# EAGLE design PiKeyboard (EAGLE 7.5.0)
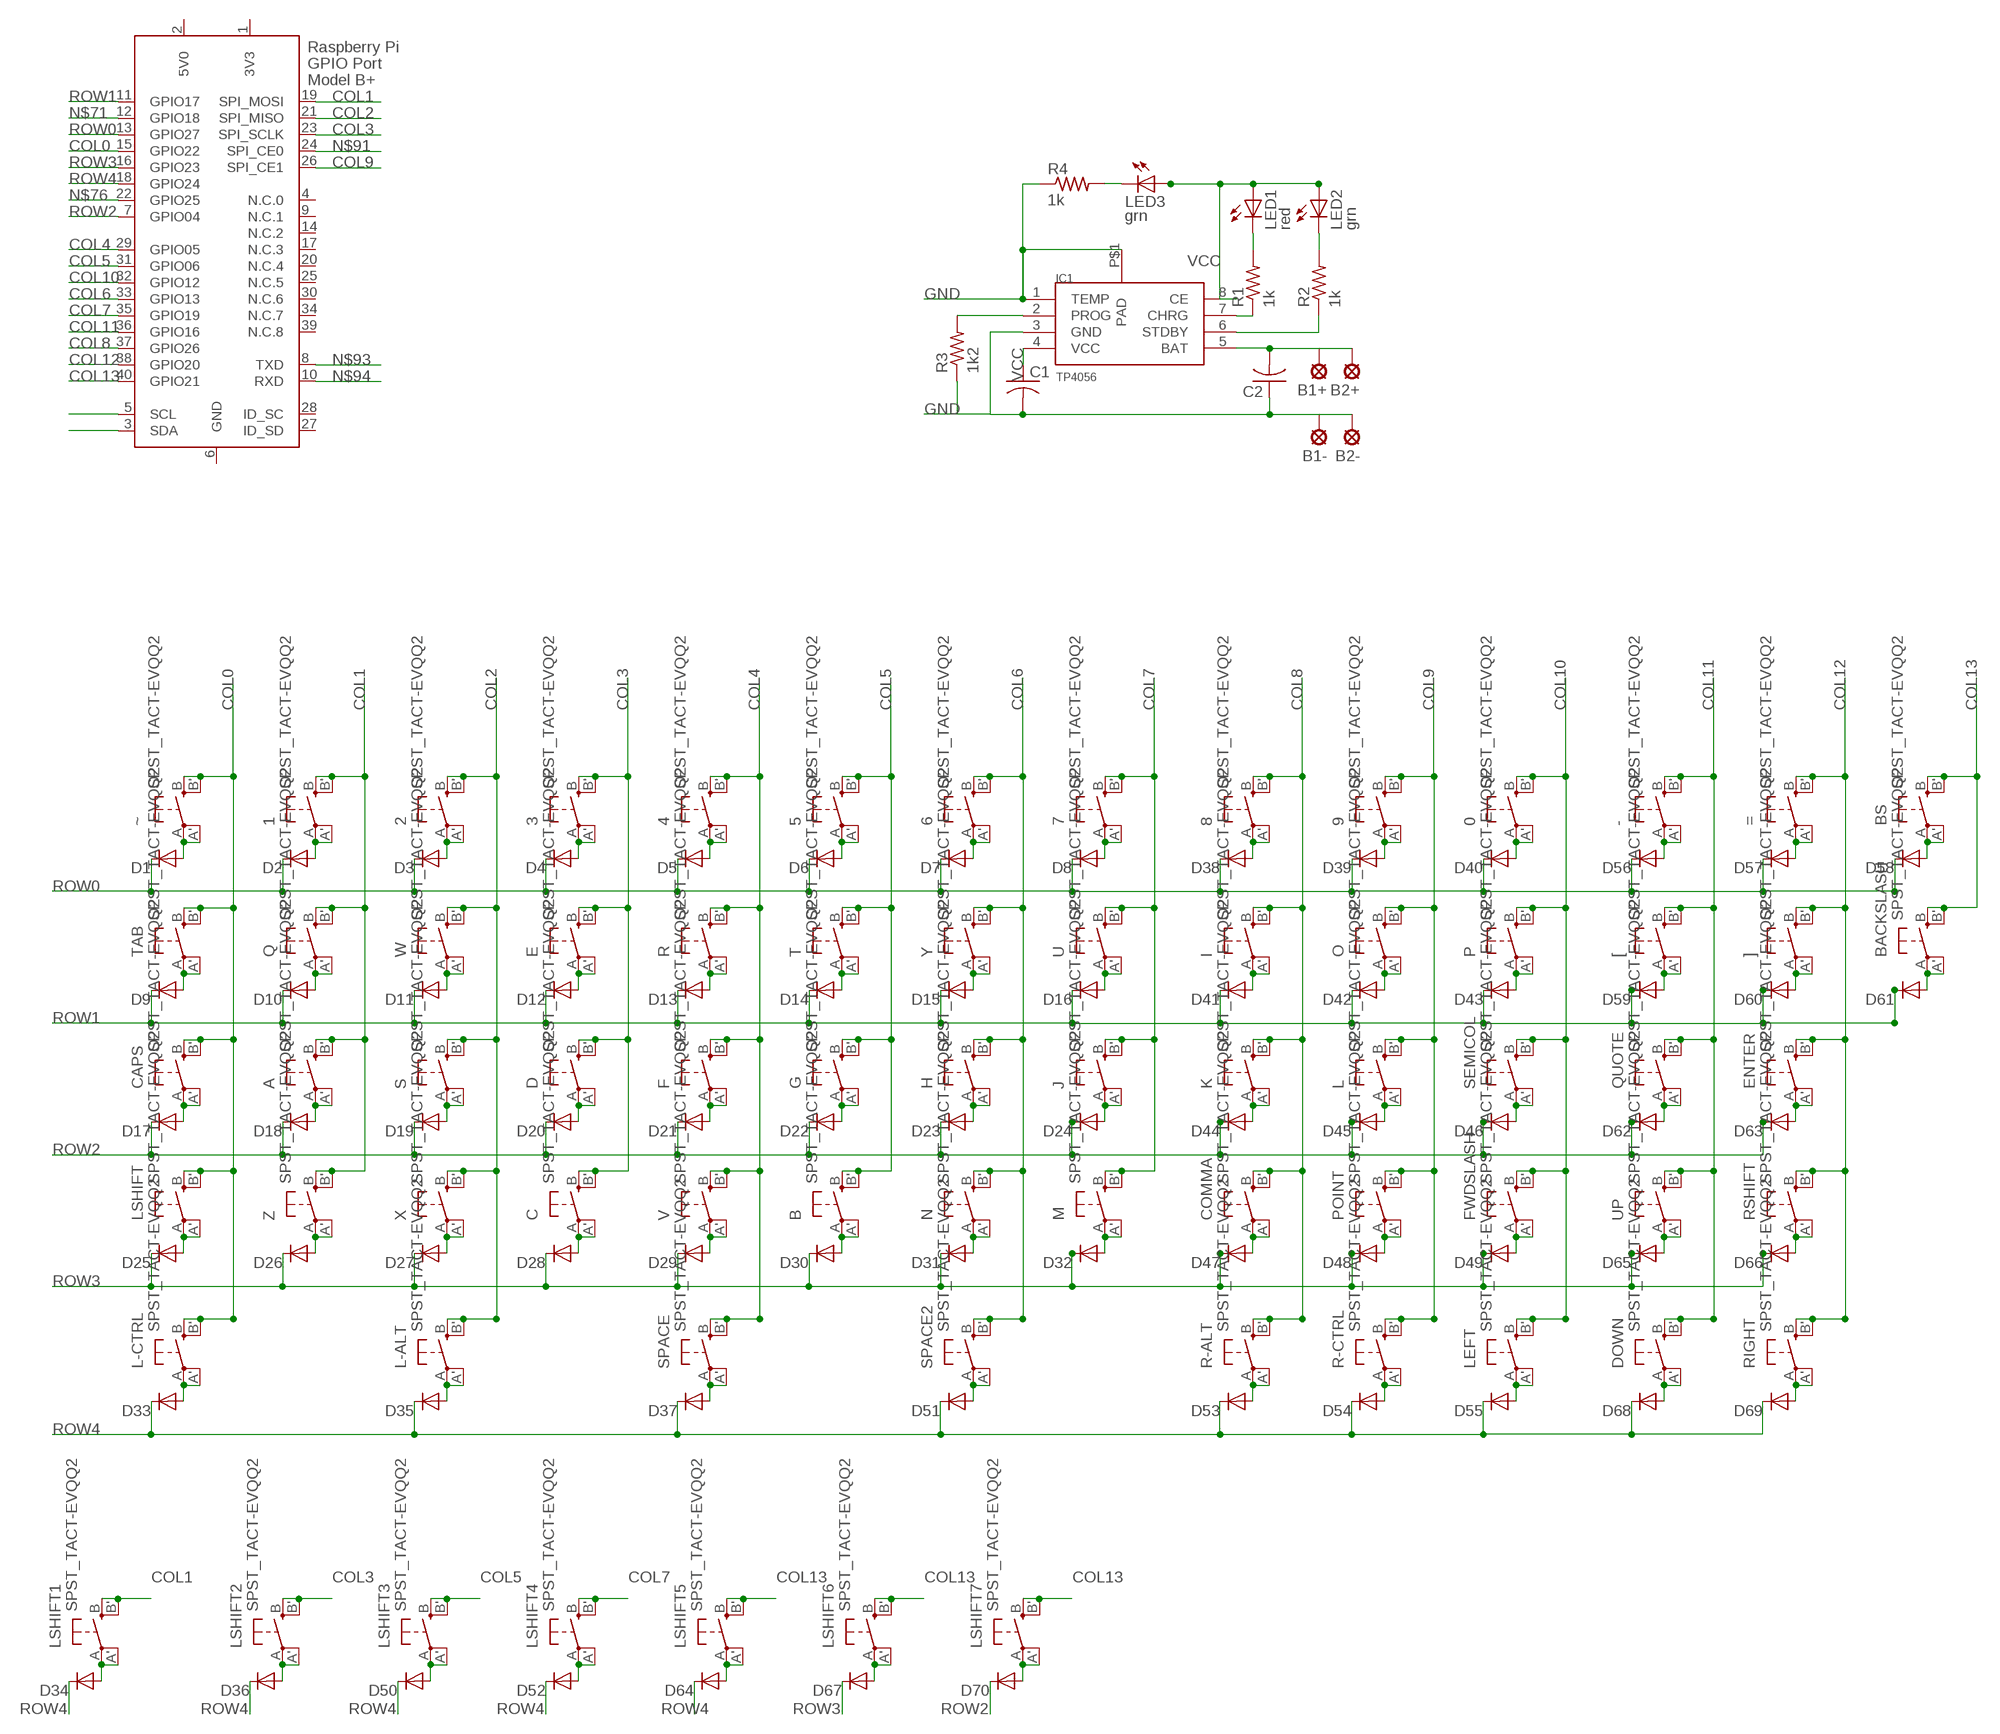
[diagram p0: schematic, sheet 1]

## Parts
0  SPST_TACT-EVQQ2  [EVQ-Q2]
1  SPST_TACT-EVQQ2  [EVQ-Q2]
2  SPST_TACT-EVQQ2  [EVQ-Q2]
3  SPST_TACT-EVQQ2  [EVQ-Q2]
4  SPST_TACT-EVQQ2  [EVQ-Q2]
5  SPST_TACT-EVQQ2  [EVQ-Q2]
6  SPST_TACT-EVQQ2  [EVQ-Q2]
7  SPST_TACT-EVQQ2  [EVQ-Q2]
8  SPST_TACT-EVQQ2  [EVQ-Q2]
9  SPST_TACT-EVQQ2  [EVQ-Q2]
-  SPST_TACT-EVQQ2  [EVQ-Q2]
=  SPST_TACT-EVQQ2  [EVQ-Q2]
[  SPST_TACT-EVQQ2  [EVQ-Q2]
]  SPST_TACT-EVQQ2  [EVQ-Q2]
A  SPST_TACT-EVQQ2  [EVQ-Q2]
B  SPST_TACT-EVQQ2  [EVQ-Q2]
B1+  SE14  [SE14]
B1-  SE14  [SE14]
B2+  SE14  [SE14]
B2-  SE14  [SE14]
BACKSLASH  SPST_TACT-EVQQ2  [EVQ-Q2]
BS  SPST_TACT-EVQQ2  [EVQ-Q2]
C  SPST_TACT-EVQQ2  [EVQ-Q2]
C1  C-USC1206K  [C1206K]
C2  C-USC1206K  [C1206K]
CAPS  SPST_TACT-EVQQ2  [EVQ-Q2]
COMMA  SPST_TACT-EVQQ2  [EVQ-Q2]
D  SPST_TACT-EVQQ2  [EVQ-Q2]
D1  DIODE-DO214AC  [DO214AC]
D2  DIODE-DO214AC  [DO214AC]
D3  DIODE-DO214AC  [DO214AC]
D4  DIODE-DO214AC  [DO214AC]
D5  DIODE-DO214AC  [DO214AC]
D6  DIODE-DO214AC  [DO214AC]
D7  DIODE-DO214AC  [DO214AC]
D8  DIODE-DO214AC  [DO214AC]
D9  DIODE-DO214AC  [DO214AC]
D10  DIODE-DO214AC  [DO214AC]
D11  DIODE-DO214AC  [DO214AC]
D12  DIODE-DO214AC  [DO214AC]
D13  DIODE-DO214AC  [DO214AC]
D14  DIODE-DO214AC  [DO214AC]
D15  DIODE-DO214AC  [DO214AC]
D16  DIODE-DO214AC  [DO214AC]
D17  DIODE-DO214AC  [DO214AC]
D18  DIODE-DO214AC  [DO214AC]
D19  DIODE-DO214AC  [DO214AC]
D20  DIODE-DO214AC  [DO214AC]
D21  DIODE-DO214AC  [DO214AC]
D22  DIODE-DO214AC  [DO214AC]
D23  DIODE-DO214AC  [DO214AC]
D24  DIODE-DO214AC  [DO214AC]
D25  DIODE-DO214AC  [DO214AC]
D26  DIODE-DO214AC  [DO214AC]
D27  DIODE-DO214AC  [DO214AC]
D28  DIODE-DO214AC  [DO214AC]
D29  DIODE-DO214AC  [DO214AC]
D30  DIODE-DO214AC  [DO214AC]
D31  DIODE-DO214AC  [DO214AC]
D32  DIODE-DO214AC  [DO214AC]
D33  DIODE-DO214AC  [DO214AC]
D34  DIODE-DO214AC  [DO214AC]
D35  DIODE-DO214AC  [DO214AC]
D36  DIODE-DO214AC  [DO214AC]
D37  DIODE-DO214AC  [DO214AC]
D38  DIODE-DO214AC  [DO214AC]
D39  DIODE-DO214AC  [DO214AC]
D40  DIODE-DO214AC  [DO214AC]
D41  DIODE-DO214AC  [DO214AC]
D42  DIODE-DO214AC  [DO214AC]
D43  DIODE-DO214AC  [DO214AC]
D44  DIODE-DO214AC  [DO214AC]
D45  DIODE-DO214AC  [DO214AC]
D46  DIODE-DO214AC  [DO214AC]
D47  DIODE-DO214AC  [DO214AC]
D48  DIODE-DO214AC  [DO214AC]
D49  DIODE-DO214AC  [DO214AC]
D50  DIODE-DO214AC  [DO214AC]
D51  DIODE-DO214AC  [DO214AC]
D52  DIODE-DO214AC  [DO214AC]
D53  DIODE-DO214AC  [DO214AC]
D54  DIODE-DO214AC  [DO214AC]
D55  DIODE-DO214AC  [DO214AC]
D56  DIODE-DO214AC  [DO214AC]
D57  DIODE-DO214AC  [DO214AC]
D58  DIODE-DO214AC  [DO214AC]
D59  DIODE-DO214AC  [DO214AC]
D60  DIODE-DO214AC  [DO214AC]
D61  DIODE-DO214AC  [DO214AC]
D62  DIODE-DO214AC  [DO214AC]
D63  DIODE-DO214AC  [DO214AC]
D64  DIODE-DO214AC  [DO214AC]
D65  DIODE-DO214AC  [DO214AC]
D66  DIODE-DO214AC  [DO214AC]
D67  DIODE-DO214AC  [DO214AC]
D68  DIODE-DO214AC  [DO214AC]
D69  DIODE-DO214AC  [DO214AC]
D70  DIODE-DO214AC  [DO214AC]
DOWN  SPST_TACT-EVQQ2  [EVQ-Q2]
E  SPST_TACT-EVQQ2  [EVQ-Q2]
ENTER  SPST_TACT-EVQQ2  [EVQ-Q2]
F  SPST_TACT-EVQQ2  [EVQ-Q2]
FWDSLASH  SPST_TACT-EVQQ2  [EVQ-Q2]
G  SPST_TACT-EVQQ2  [EVQ-Q2]
H  SPST_TACT-EVQQ2  [EVQ-Q2]
I  SPST_TACT-EVQQ2  [EVQ-Q2]
IC1  TP4056  [SOP-8]
J  SPST_TACT-EVQQ2  [EVQ-Q2]
K  SPST_TACT-EVQQ2  [EVQ-Q2]
L  SPST_TACT-EVQQ2  [EVQ-Q2]
L-ALT  SPST_TACT-EVQQ2  [EVQ-Q2]
L-CTRL  SPST_TACT-EVQQ2  [EVQ-Q2]
LED1  red  LEDCHIPLED_1206  [CHIPLED_1206]
LED2  grn  LEDCHIPLED_1206  [CHIPLED_1206]
LED3  grn  LEDCHIPLED_1206  [CHIPLED_1206]
LEFT  SPST_TACT-EVQQ2  [EVQ-Q2]
LSHIFT  SPST_TACT-EVQQ2  [EVQ-Q2]
LSHIFT1  SPST_TACT-EVQQ2  [EVQ-Q2]
LSHIFT2  SPST_TACT-EVQQ2  [EVQ-Q2]
LSHIFT3  SPST_TACT-EVQQ2  [EVQ-Q2]
LSHIFT4  SPST_TACT-EVQQ2  [EVQ-Q2]
LSHIFT5  SPST_TACT-EVQQ2  [EVQ-Q2]
LSHIFT6  SPST_TACT-EVQQ2  [EVQ-Q2]
LSHIFT7  SPST_TACT-EVQQ2  [EVQ-Q2]
M  SPST_TACT-EVQQ2  [EVQ-Q2]
N  SPST_TACT-EVQQ2  [EVQ-Q2]
O  SPST_TACT-EVQQ2  [EVQ-Q2]
P  SPST_TACT-EVQQ2  [EVQ-Q2]
POINT  SPST_TACT-EVQQ2  [EVQ-Q2]
Q  SPST_TACT-EVQQ2  [EVQ-Q2]
QUOTE  SPST_TACT-EVQQ2  [EVQ-Q2]
R  SPST_TACT-EVQQ2  [EVQ-Q2]
R1  1k  R-US_M1206  [M1206]
R2  1k  R-US_M1206  [M1206]
R3  1k2  R-US_M1206  [M1206]
R4  1k  R-US_M1206  [M1206]
R-ALT  SPST_TACT-EVQQ2  [EVQ-Q2]
R-CTRL  SPST_TACT-EVQQ2  [EVQ-Q2]
RIGHT  SPST_TACT-EVQQ2  [EVQ-Q2]
RSHIFT  SPST_TACT-EVQQ2  [EVQ-Q2]
S  SPST_TACT-EVQQ2  [EVQ-Q2]
SEMICOL  SPST_TACT-EVQQ2  [EVQ-Q2]
SPACE  SPST_TACT-EVQQ2  [EVQ-Q2]
SPACE2  SPST_TACT-EVQQ2  [EVQ-Q2]
T  SPST_TACT-EVQQ2  [EVQ-Q2]
TAB  SPST_TACT-EVQQ2  [EVQ-Q2]
U  SPST_TACT-EVQQ2  [EVQ-Q2]
UP  SPST_TACT-EVQQ2  [EVQ-Q2]
V  SPST_TACT-EVQQ2  [EVQ-Q2]
W  SPST_TACT-EVQQ2  [EVQ-Q2]
X  SPST_TACT-EVQQ2  [EVQ-Q2]
X1  RASPI_BOARD_B+_F  [RASPI_BOARD_B+_FULL]
Y  SPST_TACT-EVQQ2  [EVQ-Q2]
Z  SPST_TACT-EVQQ2  [EVQ-Q2]
~  SPST_TACT-EVQQ2  [EVQ-Q2]

## Nets
BATT+: B1+.MP B2+.MP C2.2 IC1.5(BAT)
CHGLED: IC1.7(CHRG) R1.1
CHRG: LED1.C R1.2
COL0: CAPS.B'(S1) CAPS.B(S) L-CTRL.B'(S1) L-CTRL.B(S) LSHIFT.B'(S1) LSHIFT.B(S) TAB.B'(S1) TAB.B(S) X1.15(GPIO22) ~.B'(S1) ~.B(S)
COL1: 1.B'(S1) 1.B(S) A.B'(S1) A.B(S) LSHIFT1.B'(S1) LSHIFT1.B(S) Q.B'(S1) Q.B(S) X1.19(SPI_MOSI) Z.B'(S1) Z.B(S)
COL2: 2.B'(S1) 2.B(S) L-ALT.B'(S1) L-ALT.B(S) S.B'(S1) S.B(S) W.B'(S1) W.B(S) X1.21(SPI_MISO) X.B'(S1) X.B(S)
COL3: 3.B'(S1) 3.B(S) C.B'(S1) C.B(S) D.B'(S1) D.B(S) E.B'(S1) E.B(S) LSHIFT2.B'(S1) LSHIFT2.B(S) X1.23(SPI_SCLK)
COL4: 4.B'(S1) 4.B(S) F.B'(S1) F.B(S) R.B'(S1) R.B(S) SPACE.B'(S1) SPACE.B(S) V.B'(S1) V.B(S) X1.29(GPIO05)
COL5: 5.B'(S1) 5.B(S) B.B'(S1) B.B(S) G.B'(S1) G.B(S) LSHIFT3.B'(S1) LSHIFT3.B(S) T.B'(S1) T.B(S) X1.31(GPIO06)
COL6: 6.B'(S1) 6.B(S) H.B'(S1) H.B(S) N.B'(S1) N.B(S) SPACE2.B'(S1) SPACE2.B(S) X1.33(GPIO13) Y.B'(S1) Y.B(S)
COL7: 7.B'(S1) 7.B(S) J.B'(S1) J.B(S) LSHIFT4.B'(S1) LSHIFT4.B(S) M.B'(S1) M.B(S) U.B'(S1) U.B(S) X1.35(GPIO19)
COL8: 8.B'(S1) 8.B(S) COMMA.B'(S1) COMMA.B(S) I.B'(S1) I.B(S) K.B'(S1) K.B(S) R-ALT.B'(S1) R-ALT.B(S) X1.37(GPIO26)
COL9: 9.B'(S1) 9.B(S) L.B'(S1) L.B(S) O.B'(S1) O.B(S) POINT.B'(S1) POINT.B(S) R-CTRL.B'(S1) R-CTRL.B(S) X1.26(SPI_CE1)
COL10: 0.B'(S1) 0.B(S) FWDSLASH.B'(S1) FWDSLASH.B(S) LEFT.B'(S1) LEFT.B(S) P.B'(S1) P.B(S) SEMICOL.B'(S1) SEMICOL.B(S) X1.32(GPIO12)
COL11: -.B'(S1) -.B(S) [.B'(S1) [.B(S) DOWN.B'(S1) DOWN.B(S) QUOTE.B'(S1) QUOTE.B(S) UP.B'(S1) UP.B(S) X1.36(GPIO16)
COL12: =.B'(S1) =.B(S) ].B'(S1) ].B(S) ENTER.B'(S1) ENTER.B(S) RIGHT.B'(S1) RIGHT.B(S) RSHIFT.B'(S1) RSHIFT.B(S) X1.38(GPIO20)
COL13: BACKSLASH.B'(S1) BACKSLASH.B(S) BS.B'(S1) BS.B(S) LSHIFT5.B'(S1) LSHIFT5.B(S) LSHIFT6.B'(S1) LSHIFT6.B(S) LSHIFT7.B'(S1) LSHIFT7.B(S) X1.40(GPIO21)
GND: B1-.MP B2-.MP C1.2 C2.1 IC1.1(TEMP) IC1.3(GND) IC1.P$1(PAD) R3.1 R4.1
N$1: D1.A ~.A'(P1) ~.A(P)
N$2: 1.A'(P1) 1.A(P) D2.A
N$3: 2.A'(P1) 2.A(P) D3.A
N$4: 3.A'(P1) 3.A(P) D4.A
N$5: 4.A'(P1) 4.A(P) D5.A
N$6: 5.A'(P1) 5.A(P) D6.A
N$7: 6.A'(P1) 6.A(P) D7.A
N$8: 7.A'(P1) 7.A(P) D8.A
N$9: D9.A TAB.A'(P1) TAB.A(P)
N$10: D10.A Q.A'(P1) Q.A(P)
N$11: D11.A W.A'(P1) W.A(P)
N$12: D12.A E.A'(P1) E.A(P)
N$13: D13.A R.A'(P1) R.A(P)
N$14: D14.A T.A'(P1) T.A(P)
N$15: D15.A Y.A'(P1) Y.A(P)
N$16: D16.A U.A'(P1) U.A(P)
N$17: CAPS.A'(P1) CAPS.A(P) D17.A
N$18: A.A'(P1) A.A(P) D18.A
N$19: D19.A S.A'(P1) S.A(P)
N$20: D20.A D.A'(P1) D.A(P)
N$21: D21.A F.A'(P1) F.A(P)
N$22: D22.A G.A'(P1) G.A(P)
N$23: D23.A H.A'(P1) H.A(P)
N$24: D24.A J.A'(P1) J.A(P)
N$25: D25.A LSHIFT.A'(P1) LSHIFT.A(P)
N$26: D26.A Z.A'(P1) Z.A(P)
N$27: D27.A X.A'(P1) X.A(P)
N$28: C.A'(P1) C.A(P) D28.A
N$29: D29.A V.A'(P1) V.A(P)
N$30: B.A'(P1) B.A(P) D30.A
N$31: D31.A N.A'(P1) N.A(P)
N$32: D32.A M.A'(P1) M.A(P)
N$33: D33.A L-CTRL.A'(P1) L-CTRL.A(P)
N$34: D34.A LSHIFT1.A'(P1) LSHIFT1.A(P)
N$35: D36.A LSHIFT2.A'(P1) LSHIFT2.A(P)
N$36: D50.A LSHIFT3.A'(P1) LSHIFT3.A(P)
N$37: D37.A SPACE.A'(P1) SPACE.A(P)
N$38: 8.A'(P1) 8.A(P) D38.A
N$39: 9.A'(P1) 9.A(P) D39.A
N$40: 0.A'(P1) 0.A(P) D40.A
N$41: D41.A I.A'(P1) I.A(P)
N$42: D42.A O.A'(P1) O.A(P)
N$43: D43.A P.A'(P1) P.A(P)
N$44: D44.A K.A'(P1) K.A(P)
N$45: D45.A L.A'(P1) L.A(P)
N$46: D46.A SEMICOL.A'(P1) SEMICOL.A(P)
N$47: COMMA.A'(P1) COMMA.A(P) D47.A
N$48: D48.A POINT.A'(P1) POINT.A(P)
N$49: D49.A FWDSLASH.A'(P1) FWDSLASH.A(P)
N$50: D52.A LSHIFT4.A'(P1) LSHIFT4.A(P)
N$51: D51.A SPACE2.A'(P1) SPACE2.A(P)
N$52: D64.A LSHIFT5.A'(P1) LSHIFT5.A(P)
N$53: D53.A R-ALT.A'(P1) R-ALT.A(P)
N$54: D54.A R-CTRL.A'(P1) R-CTRL.A(P)
N$55: D55.A LEFT.A'(P1) LEFT.A(P)
N$56: -.A'(P1) -.A(P) D56.A
N$57: =.A'(P1) =.A(P) D57.A
N$58: BS.A'(P1) BS.A(P) D58.A
N$59: [.A'(P1) [.A(P) D59.A
N$60: ].A'(P1) ].A(P) D60.A
N$61: BACKSLASH.A'(P1) BACKSLASH.A(P) D61.A
N$62: D62.A QUOTE.A'(P1) QUOTE.A(P)
N$63: D63.A ENTER.A'(P1) ENTER.A(P)
N$64: D67.A LSHIFT6.A'(P1) LSHIFT6.A(P)
N$65: D65.A UP.A'(P1) UP.A(P)
N$66: D66.A RSHIFT.A'(P1) RSHIFT.A(P)
N$67: D70.A LSHIFT7.A'(P1) LSHIFT7.A(P)
N$68: D68.A DOWN.A'(P1) DOWN.A(P)
N$69: D69.A RIGHT.A'(P1) RIGHT.A(P)
N$71: X1.12(GPIO18)
N$75: LED3.C R4.2
N$76: X1.22(GPIO25)
N$87: X1.5(SCL)
N$88: X1.3(SDA)
N$91: X1.24(SPI_CE0)
N$93: X1.8(TXD)
N$94: X1.10(RXD)
PROG: IC1.2(PROG) R3.2
ROW0: D1.C D2.C D3.C D4.C D5.C D6.C D7.C D8.C D38.C D39.C D40.C D56.C D57.C D58.C X1.13(GPIO27)
ROW1: D9.C D10.C D11.C D12.C D13.C D14.C D15.C D16.C D41.C D42.C D43.C D59.C D60.C D61.C X1.11(GPIO17)
ROW2: D17.C D18.C D19.C D20.C D21.C D22.C D23.C D24.C D44.C D45.C D46.C D62.C D63.C D70.C X1.7(GPIO04)
ROW3: D25.C D26.C D27.C D28.C D29.C D30.C D31.C D32.C D47.C D48.C D49.C D65.C D66.C D67.C X1.16(GPIO23)
ROW4: D33.C D34.C D35.C D36.C D37.C D50.C D51.C D52.C D53.C D54.C D55.C D64.C D68.C D69.C X1.18(GPIO24)
SBYLED: IC1.6(STDBY) R2.1
SPCEBAR: D35.A L-ALT.A'(P1) L-ALT.A(P)
STANDBY: LED2.C R2.2
VCC: C1.1 IC1.4(VCC) IC1.8(CE) LED1.A LED2.A LED3.A
Unconnected: X1.4(N.C.0) X1.9(N.C.1) X1.14(N.C.2) X1.17(N.C.3) X1.20(N.C.4) X1.25(N.C.5) X1.27(ID_SD) X1.28(ID_SC) X1.30(N.C.6) X1.34(N.C.7) X1.39(N.C.8)

## Power pins joined to a net without a drawn wire
3V3: X1.1(3V3)
5V0: X1.2(5V0)
GND: X1.6(GND)

## Library data of the parts
0 1-9 - = [ ] A B BACKSLASH BS C CAPS COMMA D DOWN E ENTER F FWDSLASH G H I J K L L-ALT L-CTRL LEFT LSHIFT LSHIFT1-LSHIFT7 M N O P POINT Q QUOTE R R-ALT R-CTRL RIGHT RSHIFT S SEMICOL SPACE SPACE2 T TAB U UP V W X Y Z ~ = adafruit:SPST_TACT: SMT 6mm switch, EVQQ2 series http://www.ladyada.net/library/eagle
B1+ B1- B2+ B2- = solpad:SE14: SOLDER PAD E1553, drill 1,4mm, distributor Buerklin, 07F820
C1 C2 = adafruit:C-US: CAPACITOR, American symbol
D1-D70 = diode:DIODE-: DIODE
IC1 = TP4056:TP4056
LED1-LED3 = adafruit:LED: LED OSRAM: - CHIPLED LG R971, LG N971, LY N971, LG Q971, LY Q971, LO R971, LY R971 LH N974, LH R974 LS Q976, LO Q976, LY Q976 LO Q996 - Hyper CHIPLED LW Q18S LB Q993, LB Q99A, LB R99A - SideLED LS A670, LO A670, LY A670, LG A670, LP A670 LB A673, LV A673, LT A673, LW A673 LH A674 LY A675 LS A676, LA A676, LO A676, LY A676, LW A676 LS A679, LY A679, LG A679 - Hyper Micro SIDELED® LS Y876, LA Y876, LO Y876, LY Y876 LT Y87S - SmartLED LW L88C, LW L88S LB L89C, LB L89S, LG L890 LS L89K, LO L89K, LY L89K LS L896, LA L896, LO L896, LY L896 - TOPLED LS T670, LO T670, LY T670, LG T670, LP T670 LSG T670, LSP T670, LSY T670, LOP T670, LYG T670 LG T671, LOG T671, LSG T671 LB T673, LV T673, LT T673, LW T673 LH T674 LS T676, LA T676, LO T676, LY T676, LB T676, LH T676, LSB T676, LW T676 LB T67C, LV T67C, LT T67C, LS T67K, LO T67K, LY T67K, LW E67C LS E67B, LA E67B, LO E67B, LY E67B, LB E67C, LV E67C, LT E67C LW T67C LS T679, LY T679, LG T679 LS T770, LO T770, LY T770, LG T770, LP T770 LB T773, LV T773, LT T773, LW T773 LH T774 LS E675, LA E675, LY E675, LS T675 LS T776, LA T776, LO T776, LY T776, LB T776 LHGB T686 LT T68C, LB T68C - Hyper Mini TOPLED® LB M676 - Mini TOPLED Santana® LG M470 LS M47K, LO M47K, LY M47K Source: http://www.osram.convergy.de/
R1-R4 = adafruit:R-US_: RESISTOR, American symbol
X1 = raspberrypi_bastelstube_v13:RASPI_BOARD_B+: Raspberry Pi GPIO connector with markings for the outer dimensions of the Raspberry Pi board model B+ with different sets of drill holes or mounting pads

## Board
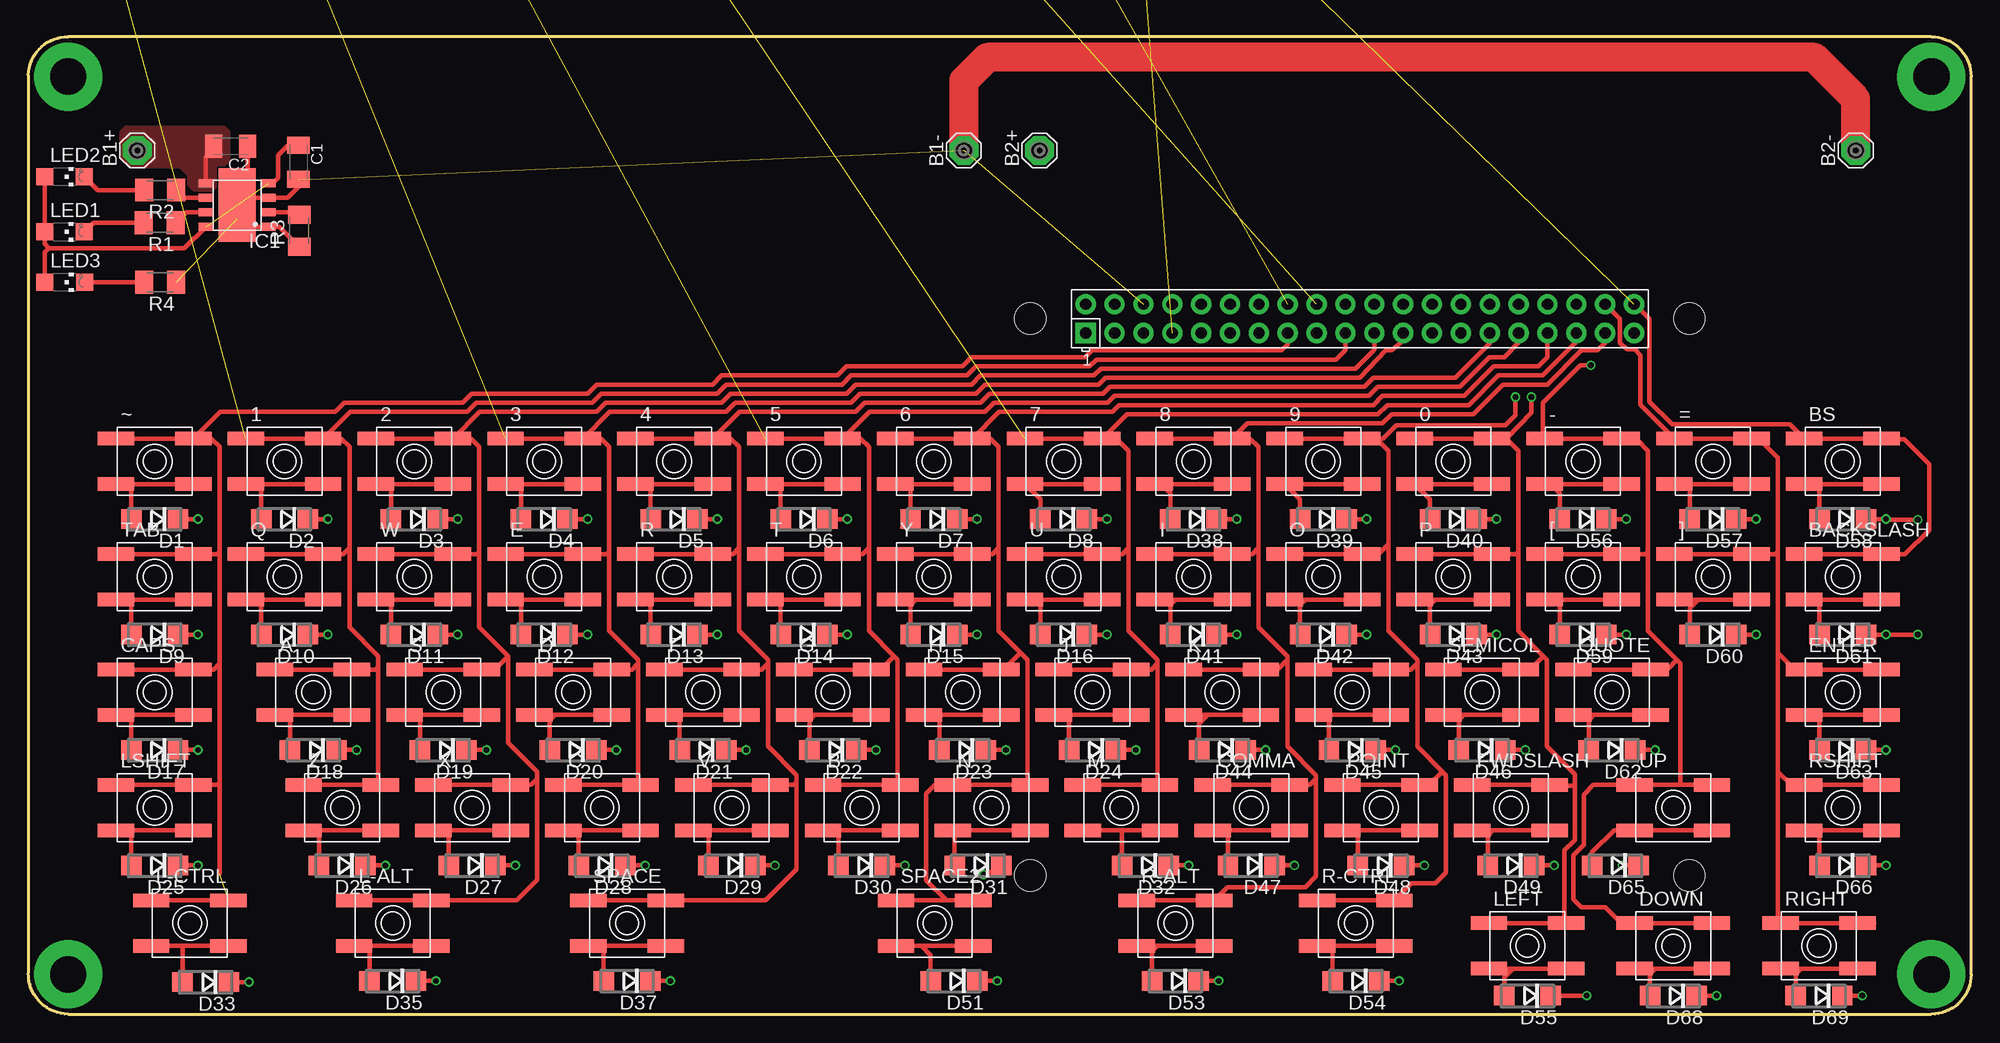
[diagram p1: board, top side]
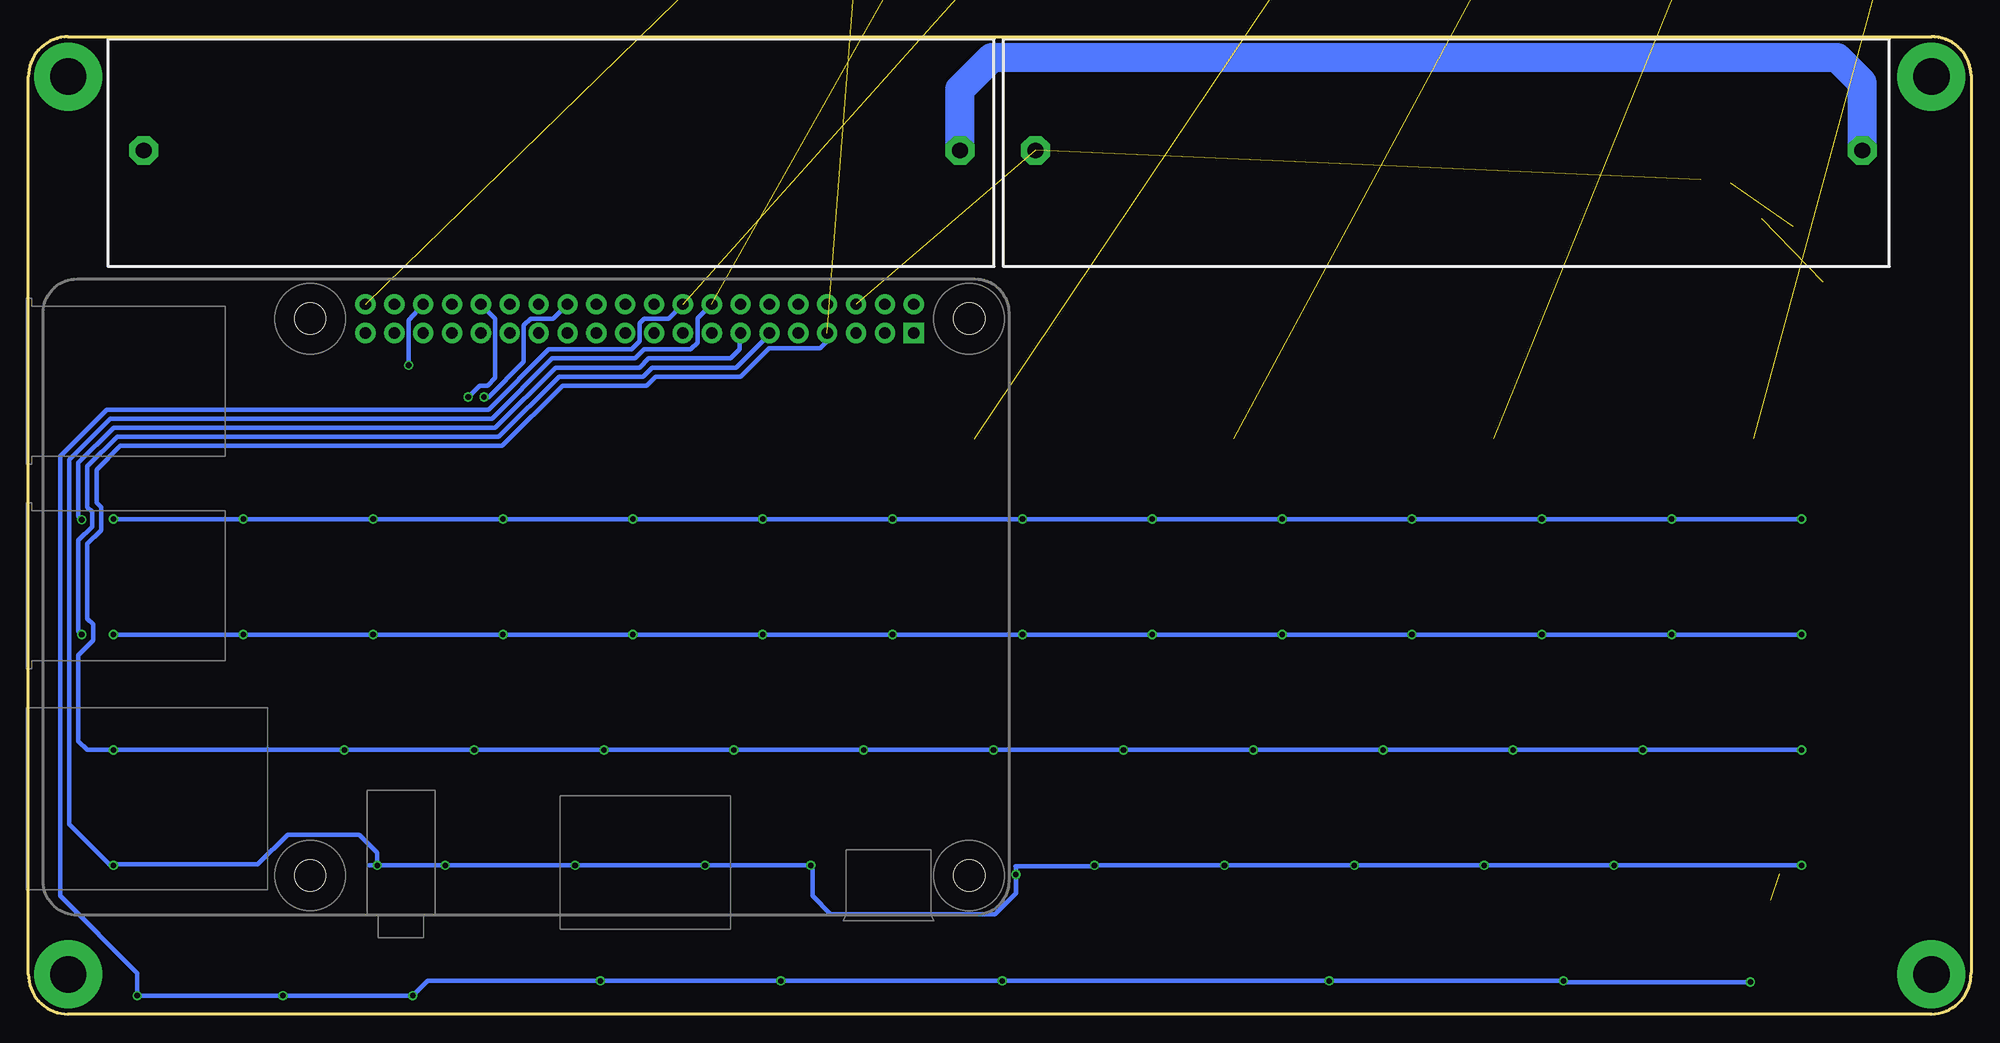
[diagram p2: board, bottom side, seen from below]

Size 171 x 86 mm. Coordinates in mm from the lower left corner, seen from the top.
Outline: 3.5,0 167.5,0 arc90 171,3.5 171,82.5 arc90 167.5,86 3.5,86 arc90 0,82.6 0,3.6 arc90 3.5,0
Copper layers (1*16): Top 0.035mm / dielectric 1.5mm / Bottom 0.035mm
Design rules "dirt_cheap_dirty_boards.v1": minimum track width 5mil, minimum drill 12mil, track to track 5mil, track to pad 5mil, pad to pad 5mil, via to via 5mil, smd to smd 0mil, copper to edge 10mil, drill to drill 10mil, minimum pad ring 10mil, minimum via ring 6mil, stop-mask expansion 2mil, vias tented up to drill 25mil, thermal gap 10mil

### Footprints (pad centres in the part's own frame; a part is rotated, then mirrored left to right if it is on the bottom)
EVQ-Q2 = smd 3.2 x 1.2: A -3.4,-2; A' 3.4,-2; B -3.4,2; B' 3.4,2
SE14 = drill 1.397 pad 2.54 octagon: MP 0,0
C1206K = smd 1.5 x 2: 1 -1.5,0; 2 1.5,0
DO214AC = smd 1.8 x 1.7: A 2.05,0; C -2.05,0
SOP-8 = smd 1.3 x 0.7: 1 -2.75,1.905; 2 -2.75,0.635; 3 -2.75,-0.635; 4 -2.75,-1.905; 5 2.75,-1.905; 6 2.75,-0.635; 7 2.75,0.635; 8 2.75,1.905 | smd 3.251 x 6.452: P$1 0,0
CHIPLED_1206 = smd 1.5 x 1.5: A 0,-1.75; C 0,1.75
M1206 = smd 1.6 x 2: 1 -1.4,0; 2 1.4,0
RASPI_BOARD_B+_FULL = drill 1 pad 1.778 square: 1 8.37,51.23 | drill 1 pad 1.778: 2 8.37,53.77; 3 10.91,51.23; 4 10.91,53.77; 5 13.45,51.23; 6 13.45,53.77; 7 15.99,51.23; 8 15.99,53.77; 9 18.53,51.23; 10 18.53,53.77; 11 21.07,51.23; 12 21.07,53.77; 13 23.61,51.23; 14 23.61,53.77; 15 26.15,51.23; 16 26.15,53.77; 17 28.69,51.23; 18 28.69,53.77; 19 31.23,51.23; 20 31.23,53.77; 21 33.77,51.23; 22 33.77,53.77; 23 36.31,51.23; 24 36.31,53.77; 25 38.85,51.23; 26 38.85,53.77; 27 41.39,51.23; 28 41.39,53.77; 29 43.93,51.23; 30 43.93,53.77; 31 46.47,51.23; 32 46.47,53.77; 33 49.01,51.23; 34 49.01,53.77; 35 51.55,51.23; 36 51.55,53.77; 37 54.09,51.23; 38 54.09,53.77; 39 56.63,51.23; 40 56.63,53.77 | hole 2.75: 3.5,3.5; 3.5,52.5; 61.5,3.5; 61.5,52.5

### Placement (x,y rotation side)
0  125.42,48.64 0 top
1  22.55,48.64 0 top
2  33.98,48.64 0 top
3  45.41,48.64 0 top
4  56.84,48.64 0 top
5  68.27,48.64 0 top
6  79.69,48.64 0 top
7  91.12,48.64 0 top
8  102.56,48.64 0 top
9  113.98,48.64 0 top
-  136.84,48.64 0 top
=  148.28,48.64 0 top
[  136.84,38.48 0 top
]  148.28,38.48 0 top
A  25.09,28.32 0 top
B  73.34,18.16 0 top
B1+  9.58,76 90 top
B1-  82.34,76 90 top
B2+  89,76 90 top
B2-  160.85,76 90 top
BACKSLASH  159.71,38.48 0 top
BS  159.71,48.64 0 top
C  50.48,18.16 0 top
C1  23.77,74.97 270 top
C2  17.81,76.38 180 top
CAPS  11.12,28.32 0 top
COMMA  107.64,18.16 0 top
D  47.95,28.32 0 top
D1  11.12,43.56 180 top
D2  22.55,43.56 180 top
D3  33.98,43.56 180 top
D4  45.41,43.56 180 top
D5  56.84,43.56 180 top
D6  68.27,43.56 180 top
D7  79.69,43.56 180 top
D8  91.12,43.56 180 top
D9  11.12,33.4 180 top
D10  22.55,33.4 180 top
D11  33.98,33.4 180 top
D12  45.41,33.4 180 top
D13  56.84,33.4 180 top
D14  68.27,33.4 180 top
D15  79.69,33.4 180 top
D16  91.12,33.4 180 top
D17  11.12,23.24 180 top
D18  25.09,23.24 180 top
D19  36.52,23.24 180 top
D20  47.95,23.24 180 top
D21  59.38,23.24 180 top
D22  70.81,23.24 180 top
D23  82.23,23.24 180 top
D24  93.67,23.24 180 top
D25  11.12,13.08 180 top
D26  27.62,13.08 180 top
D27  39.05,13.08 180 top
D28  50.48,13.08 180 top
D29  61.91,13.08 180 top
D30  73.34,13.08 180 top
D31  83.58,13.08 180 top
D32  98.32,13.08 180 top
D33  15.62,2.82 180 top
D34  8.7,116.1 90 top  (outside the outline)
D35  32.07,2.92 180 top
D36  23.3,116.1 90 top  (outside the outline)
D37  52.7,2.92 180 top
D38  102.56,43.56 180 top
D39  113.98,43.56 180 top
D40  125.42,43.56 180 top
D41  102.56,33.4 180 top
D42  113.98,33.4 180 top
D43  125.42,33.4 180 top
D44  105.09,23.24 180 top
D45  116.53,23.24 180 top
D46  127.95,23.24 180 top
D47  107.64,13.08 180 top
D48  119.06,13.08 180 top
D49  130.5,13.08 180 top
D50  37.9,116.1 90 top  (outside the outline)
D51  81.47,2.92 180 top
D52  52.7,116.1 90 top  (outside the outline)
D53  100.97,2.92 180 top
D54  116.84,2.92 180 top
D55  131.95,1.62 180 top
D56  136.84,43.56 180 top
D57  148.28,43.56 180 top
D58  159.71,43.56 180 top
D59  136.84,33.4 180 top
D60  148.28,33.4 180 top
D61  159.71,33.4 180 top
D62  139.38,23.24 180 top
D63  159.71,23.24 180 top
D64  67.3,116.1 90 top  (outside the outline)
D65  139.68,13.08 180 top
D66  159.71,13.08 180 top
D67  81.9,115.9 90 top  (outside the outline)
D68  144.78,1.62 180 top
D69  157.61,1.62 180 top
D70  96.5,116 90 top  (outside the outline)
DOWN  144.78,6 0 top
E  45.41,38.48 0 top
ENTER  159.71,28.32 0 top
F  59.38,28.32 0 top
FWDSLASH  130.5,18.16 0 top
G  70.81,28.32 0 top
H  82.23,28.32 0 top
I  102.56,38.48 0 top
IC1  18.38,71.2 180 top
J  93.67,28.32 0 top
K  105.09,28.32 0 top
L  116.53,28.32 0 top
L-ALT  32.07,8 0 top
L-CTRL  14.21,8 0 top
LED1  3.18,68.83 270 top
LED2  3.18,73.69 270 top
LED3  3.2,64.4 270 top
LEFT  131.95,6 0 top
LSHIFT  11.12,18.16 0 top
LSHIFT1  4.3,116 90 top  (outside the outline)
LSHIFT2  18.9,116 90 top  (outside the outline)
LSHIFT3  33.5,116 90 top  (outside the outline)
LSHIFT4  48.1,116 90 top  (outside the outline)
LSHIFT5  62.7,116 90 top  (outside the outline)
LSHIFT6  77.3,116 90 top  (outside the outline)
LSHIFT7  91.9,116 90 top  (outside the outline)
M  96.2,18.16 0 top
N  84.78,18.16 0 top
O  113.98,38.48 0 top
P  125.42,38.48 0 top
POINT  119.06,18.16 0 top
Q  22.55,38.48 0 top
QUOTE  139.38,28.32 0 top
R  56.84,38.48 0 top
R1  11.56,69.64 180 top
R2  11.6,72.51 180 top
R3  23.85,68.93 90 top
R4  11.6,64.4 180 top
R-ALT  100.97,8 0 top
R-CTRL  116.84,8 0 top
RIGHT  157.61,6 0 top
RSHIFT  159.71,18.16 0 top
S  36.52,28.32 0 top
SEMICOL  127.95,28.32 0 top
SPACE  52.7,8 0 top
SPACE2  79.77,8 0 top
T  68.27,38.48 0 top
TAB  11.12,38.48 0 top
U  91.12,38.48 0 top
UP  144.78,18.16 0 top
V  61.91,18.16 0 top
W  33.98,38.48 0 top
X  39.05,18.16 0 top
X1  84.7,8.7 0 top
Y  79.69,38.48 0 top
Z  27.62,18.16 0 top
~  11.12,48.64 0 top

### Tracks (layer width: path | path; a pad name or v marks a point on that pad's centre or on a via)
BATT+
  Top 0.406: C2.2 16.31,76.11 15.6,75.4 15.6,73.14 IC1.5
  Bottom 2.54: B2+.MP 89,81.4 86.2,84.2 11.8,84.2 9.58,81.98 B1+.MP
  pour Top (no thermals): 8.2,77.6 8.2,75.4 9,74.6 13.4,74.6 14.2,73.8 14.2,73 14.6,72.6 16.2,72.6 16.4,72.8 16.4,74.6 16.6,74.8 17.2,74.8 17.6,75.2 17.6,77.6 17.2,78 8.6,78
CHGLED
  Top 0.406: IC1.7 13.88,70.56 R1.1
CHRG
  Top 0.406: R1.2 5.74,69.64 LED1.C
COL0  (1 unrouted)
  Top 0.406: ~.B' 16.1,50.64 16.83,49.91 16.83,40.7 | 16.83,40.7 16.83,30.86 | 16.83,30.86 16.83,20.39 | 16.83,20.39 16.83,12.34 | ~.B ~.B' | TAB.B TAB.B' 16.61,40.48 16.83,40.7 | CAPS.B CAPS.B' 16.29,30.32 16.83,30.86 | LSHIFT.B LSHIFT.B' 16.61,20.16 16.83,20.39 | L-CTRL.B L-CTRL.B' | X1.15 110.85,58.95 110.3,58.4 93.6,58.4 93,57.8 83,57.8 82.2,57 72,57 71.2,56.2 61,56.2 60.2,55.4 50,55.4 49.2,54.6 39,54.6 38.2,53.8 27.8,53.8 27,53 16.87,53 ~.B'
COL1  (2 unrouted)
  Top 0.406: 1.B' 27.53,50.64 28.26,49.91 28.26,41.02 | 28.26,41.02 28.26,34.04 30.8,31.5 30.8,30.55 | 30.8,30.55 30.8,20.39 Z.B' Z.B | A.B A.B' 30.58,30.32 30.8,30.55 | Q.B Q.B' 27.72,40.48 28.26,41.02 | 1.B 1.B' | 1.B' 28.3,53 38.6,53 39.4,53.8 49.6,53.8 50.4,54.6 60.6,54.6 61.4,55.4 71.6,55.4 72.4,56.2 82.6,56.2 83.4,57 93.4,57 94,57.6 115.1,57.6 115.93,58.43 X1.19
COL2
  Top 0.406: 44.77,20.7 44.77,11.81 42.96,10 L-ALT.B' L-ALT.B | 44.77,20.7 44.77,21.34 42.23,23.88 42.23,31.5 | 42.23,31.5 39.69,34.04 39.69,40.7 | 39.69,40.7 39.69,49.91 38.96,50.64 2.B' | 2.B 2.B' | W.B 36.74,40.48 36.83,40.39 37.28,40.39 W.B' 39.47,40.48 39.69,40.7 | S.B S.B' 41.05,30.32 42.23,31.5 | X.B X.B' 44.23,20.16 44.77,20.7 | 2.B' 39.73,53 50,53 50.8,53.8 61,53.8 61.8,54.6 72,54.6 72.8,55.4 83,55.4 83.8,56.2 93.8,56.2 94.4,56.8 116.8,56.8 118.47,58.47 X1.21
COL3  (2 unrouted)
  Top 0.406: 3.B' 50.39,50.64 51.12,49.91 51.12,40.7 | 51.12,40.7 51.12,33.72 53.66,31.18 53.66,30.86 | 53.66,30.86 53.66,20.39 C.B' 53.79,20.07 53.34,20.07 53.25,20.16 C.B | D.B D.B' 53.12,30.32 53.66,30.86 | E.B E.B' 50.9,40.48 51.12,40.7 | 3.B 47.85,50.64 47.95,50.55 48.71,50.55 3.B' | 3.B' 51.16,53 61.4,53 62.2,53.8 72.4,53.8 73.2,54.6 83.4,54.6 84.2,55.4 94.2,55.4 94.8,56 117.2,56 119.5,58.4 120,58.4 121.01,59.31 X1.23
COL4
  Top 0.406: 4.B' 61.82,50.64 62.55,49.91 62.55,41.02 | 62.55,41.02 62.55,33.72 65.09,31.18 65.09,30.86 | 65.09,30.86 65.09,23.56 67.63,21.02 67.63,20.39 | 67.63,20.39 67.63,12.77 64.87,10 SPACE.B' SPACE.B | V.B V.B' 67.41,20.16 67.63,20.39 | F.B F.B' 64.55,30.32 65.09,30.86 | R.B R.B' 62.01,40.48 62.55,41.02 | 4.B 4.B' | 4.B' 62.59,53 72.8,53 73.6,53.8 83.8,53.8 84.6,54.6 94.6,54.6 95.2,55.2 117.6,55.2 118.4,56 125.6,56 128.63,59.03 X1.29
COL5  (2 unrouted)
  Top 0.406: 5.B' 73.25,50.64 73.98,49.91 73.98,41.02 | 73.98,41.02 73.98,33.72 76.2,31.5 | 76.2,31.5 76.52,31.18 76.52,20.39 B.B' B.B | 5.B 5.B' | T.B T.B' 73.44,40.48 73.98,41.02 | G.B G.B' 75.03,30.32 76.2,31.5 | 5.B' 74.02,53 84.2,53 85,53.8 95,53.8 95.6,54.4 118,54.4 118.8,55.2 126,55.2 128.6,57.8 129.9,57.8 131.17,59.07 X1.31
COL6
  Top 0.406: 6.B' 84.68,50.64 85.41,49.91 85.41,41.02 | 85.41,41.02 85.41,33.72 87.31,31.82 | 87.31,31.82 87.95,31.18 87.95,20.39 N.B' | 6.B 6.B' | Y.B Y.B' | Y.B' 83.41,40.48 83.82,40.07 83.51,40.07 Y.B' | Y.B' 84.87,40.48 85.41,41.02 | H.B H.B' 85.82,30.32 87.31,31.82 | N.B 82,20.16 | 82,20.16 N.B' | N.B' 88.36,20.16 | SPACE2.B SPACE2.B' 80.8,10 79,11.8 79,19.4 79.8,20.2 81.96,20.2 82,20.16 | 6.B' 85.45,53 95.4,53 96,53.6 118.4,53.6 119.2,54.4 126.4,54.4 129,57 132.9,57 133.71,57.81 X1.33
COL7  (2 unrouted)
  Top 0.406: 7.B' 95.79,50.64 96.84,49.59 96.84,41.02 | 96.84,41.02 96.84,33.72 99.38,31.18 99.38,30.86 | 99.38,30.86 99.38,20.39 M.B' M.B | 7.B 93.44,50.64 93.67,50.87 94.3,50.87 7.B' | U.B U.B' 96.3,40.48 96.84,41.02 | J.B J.B' 98.84,30.32 99.38,30.86 | 7.B' 96.68,52.8 118.8,52.8 119.6,53.6 126.8,53.6 129.4,56.2 133.3,56.2 136.25,59.15 X1.35
COL8
  Top 0.406: 8.B' 107.54,50.64 108.27,49.91 108.27,41.02 | 108.27,41.02 108.27,34.04 110.81,31.5 110.81,31.18 | 110.81,31.18 110.81,23.56 113.35,21.02 113.35,20.7 | 113.35,20.7 113.35,12.13 112.4,11.18 105.54,11.18 R-ALT.B' 104.14,9.78 104.14,9.59 103.73,10 R-ALT.B | COMMA.B COMMA.B' 112.81,20.16 113.35,20.7 | K.B K.B' 109.95,30.32 110.81,31.18 | I.B I.B' 107.73,40.48 108.27,41.02 | 8.B 105.19,50.64 105.41,50.87 105.73,50.87 8.B' | 8.B' 107.31,52 119.2,52 120,52.8 127.2,52.8 129.8,55.4 133.7,55.4 136.7,58.4 138.1,58.4 138.79,59.09 X1.37
COL9  (via drill 0.5)
  Top 0.406: 118.65,50.64 9.B' 9.B | 118.65,50.64 119.7,49.59 119.7,41.34 | 119.7,41.34 119.7,33.72 122.24,31.18 122.24,30.86 | 122.24,30.86 122.24,23.56 124.46,21.34 | 124.46,21.34 124.78,21.02 124.78,12.45 123.83,11.49 121.73,11.49 R-CTRL.B' R-CTRL.B | O.B O.B' 118.84,40.48 119.7,41.34 | L.B 119.16,30.32 119.38,30.55 119.7,30.55 L.B' 121.7,30.32 122.24,30.86 | POINT.B POINT.B' 123.29,20.16 124.46,21.34 | 118.65,50.64 119.24,50.64 120.4,51.8 130,51.8 130.9,52.7 v130.9,54.3
  Bottom 0.406: 130.9,54.4 v130.9,54.3 130.5,54.3 127.4,57.4 127.4,60.6 126.8,61.2 124.8,61.2 123.55,62.45 X1.26
COL10  (via drill 0.5)
  Top 0.406: 130.08,50.64 0.B' 0.B | 130.08,50.64 131.13,49.59 131.13,40.7 | 131.13,40.7 131.13,33.72 133.35,31.5 | 133.35,31.5 133.67,31.18 133.67,23.56 136.11,21.12 136.11,20.11 | P.B P.B' 130.91,40.48 131.13,40.7 | SEMICOL.B SEMICOL.B' 132.18,30.32 133.35,31.5 | FWDSLASH.B FWDSLASH.B' 134.5,20.16 | 134.5,20.16 135.03,20.16 | LEFT.B LEFT.B' 135.2,8.15 135.2,14.4 136.11,15.31 136.11,20.11 | v132.3,54.3 132.3,52.9 131.24,51.8 130.08,50.64 | 136.11,20.11 136.1,20.1 134.56,20.1 134.5,20.16
  Bottom 0.406: X1.32 129.9,61.2 129.9,56 130.6,55.3 131.3,55.3 v132.3,54.3
COL11  (via drill 0.5)
  Top 0.406: 142.56,40.7 142.56,49.59 141.51,50.64 -.B' -.B 133.4,50.69 133.4,50.9 133.3,51 133.3,53.8 136.6,57.1 v137.53,57.1 | 142.56,40.7 142.56,33.72 145.1,31.18 | 145.1,31.18 145.42,30.86 145.42,20.38 145.2,20.16 | 145.2,20.16 UP.B 137.76,20.16 136.9,19.3 136.9,14.9 136,14 136,10.1 136.7,9.4 138.8,9.4 140.2,8 DOWN.B' DOWN.B | 145.2,20.16 UP.B' | QUOTE.B 141.51,30.32 141.61,30.23 142.69,30.23 QUOTE.B' 144.24,30.32 145.1,31.18 | [.B [.B' 142.34,40.48 142.56,40.7
  Bottom 0.406: X1.36 136.25,62.45 137.52,61.07 v137.53,57.1
COL12
  Top 0.406: 153.99,40.7 153.99,48.96 152.31,50.64 =.B' =.B 141.9,53.62 141.9,58 141.4,58.5 140.7,58.5 140.1,59.1 140.1,61.2 138.83,62.47 X1.38 | 153.99,40.7 153.99,31.82 | 153.99,31.82 153.99,21.34 | 162.47,8 RIGHT.B' 155,8 | 153.99,21.34 155.16,20.16 RSHIFT.B RSHIFT.B' | 153.99,31.82 155.48,30.32 ENTER.B 162.15,30.32 162.56,29.91 162.69,29.91 ENTER.B' | RIGHT.B 155,8 | ].B ].B' 153.77,40.48 153.99,40.7 | 153.99,21.34 153.99,9.18 153.99,8.18 154.59,7.98 154.59,7.99 155,8
COL13  (6 unrouted)
  Top 0.406: X1.40 141.43,62.47 142.7,61.2 142.7,53.9 144.7,51.9 155.05,51.9 BS.B BS.B' 163.15,50.6 165.1,50.6 167.3,48.4 167.3,42.6 165.18,40.48 BACKSLASH.B' BACKSLASH.B
GND  (3 unrouted)
  Top 0.406: R3.1 22.09,69.3 IC1.1 19.11,69.3 18.4,70 18.4,71.18 IC1.P$1 19.02,71.83 | C1.2 23.8,73.44 23.8,72.8 22.84,71.83 IC1.3 19.02,71.83 | C2.1 19.31,72.91 19,72.6 19,71.85 19.02,71.83
  Top 2.54: B2-.MP 160.85,80.55 157.2,84.2 84.4,84.2 82.34,82.14 B1-.MP
N$1
  Top 0.406: ~.A 9.21,46.64 | 9.21,46.64 ~.A' | D1.A 9.06,46.5 9.21,46.64
N$2
  Top 0.406: 1.A 20.64,46.64 | 20.64,46.64 1.A' | D2.A 20.5,46.5 20.64,46.64
N$3
  Top 0.406: 2.A 32.07,46.64 | 32.07,46.64 2.A' | D3.A 31.93,46.5 32.07,46.64
N$4
  Top 0.406: 3.A 43.18,46.64 | 43.18,46.64 3.A' | D4.A 43.35,46.47 43.18,46.64
N$5
  Top 0.406: 4.A 54.93,46.64 | 54.93,46.64 4.A' | D5.A 54.78,46.5 54.93,46.64
N$6
  Top 0.406: 5.A 66.04,46.64 | 66.04,46.64 5.A' | D6.A 66.22,46.47 66.04,46.64
N$7
  Top 0.406: 6.A 77.16,46.64 | 77.16,46.64 6.A' | D7.A 77.64,46.15 77.16,46.64
N$8
  Top 0.406: 7.A' 7.A 89.08,45.29 D8.A
N$9
  Top 0.406: TAB.A 8.89,36.48 | 8.89,36.48 TAB.A' | D9.A 9.06,36.31 8.89,36.48
N$10
  Top 0.406: Q.A 20.64,36.48 | 20.64,36.48 Q.A' | D10.A 20.5,36.34 20.64,36.48
N$11
  Top 0.406: W.A 31.43,36.48 | 31.43,36.48 36.42,36.48 36.52,36.58 37.28,36.58 W.A' | D11.A 31.93,35.99 31.43,36.48
N$12
  Top 0.406: E.A 43.5,36.48 | 43.5,36.48 E.A' | D12.A 43.35,36.34 43.5,36.48
N$13
  Top 0.406: R.A 54.93,36.48 | 54.93,36.48 R.A' | D13.A 54.78,36.34 54.93,36.48
N$14
  Top 0.406: T.A 66.36,36.48 | 66.36,36.48 T.A' | D14.A 66.22,36.34 66.36,36.48
N$15
  Top 0.406: Y.A 78.11,36.48 | 78.11,36.48 Y.A' | D15.A 77.64,36.02 78.11,36.48
N$16
  Top 0.406: U.A 88.9,36.48 | 88.9,36.48 U.A' | D16.A 89.08,36.31 88.9,36.48
N$17
  Top 0.406: CAPS.A 8.89,26.32 | 8.89,26.32 CAPS.A' | D17.A 9.06,26.15 8.89,26.32
N$18
  Top 0.406: A.A 23.18,26.32 | 23.18,26.32 A.A' | D18.A 23.04,26.18 23.18,26.32
N$19
  Top 0.406: S.A 33.98,26.32 | 33.98,26.32 S.A' | D19.A 34.47,25.83 33.98,26.32
N$20
  Top 0.406: D.A 46.36,26.32 | 46.36,26.32 50.26,26.32 50.48,26.1 51.12,26.1 D.A' | D20.A 45.9,25.86 46.36,26.32
N$21
  Top 0.406: F.A 57.47,26.32 | 57.47,26.32 62.01,26.32 62.23,26.1 62.55,26.1 F.A' | D21.A 57.33,26.18 57.47,26.32
N$22
  Top 0.406: G.A 69.22,26.32 | 69.22,26.32 G.A' | D22.A 68.75,25.86 69.22,26.32
N$23
  Top 0.406: H.A 80.33,26.32 | 80.33,26.32 H.A' | D23.A 80.19,26.18 80.33,26.32
N$24
  Top 0.406: J.A 91.76,26.32 | 91.76,26.32 J.A' | D24.A 91.61,26.18 91.76,26.32
N$25
  Top 0.406: LSHIFT.A 9.21,16.16 | 9.21,16.16 LSHIFT.A' | D25.A 9.06,16.02 9.21,16.16
N$26
  Top 0.406: Z.A 25.72,16.16 | 25.72,16.16 Z.A' | D26.A 25.57,16.02 25.72,16.16
N$27
  Top 0.406: X.A 37.15,16.16 | 37.15,16.16 X.A' | D27.A 37.01,16.02 37.15,16.16
N$28
  Top 0.406: C.A 48.58,16.16 | 48.58,16.16 C.A' | D28.A 48.44,16.02 48.58,16.16
N$29
  Top 0.406: V.A 59.69,16.16 | 59.69,16.16 V.A' | D29.A 59.87,15.99 59.69,16.16
N$30
  Top 0.406: B.A 71.12,16.16 | 71.12,16.16 B.A' | D30.A 71.3,15.99 71.12,16.16
N$31
  Top 0.406: 82.87,16.16 N.A 81.53,16.01 D31.A | 82.87,16.16 N.A' | 82.72,16.02 82.87,16.16
N$32
  Top 0.406: M.A 96.2,16.16 | 96.2,16.16 M.A' | D32.A 96.27,16.09 96.2,16.16
N$33
  Top 0.406: L-CTRL.A 13.5,6 | 13.5,6 L-CTRL.A' | D33.A 13.56,5.94 13.5,6
N$34  (2 unrouted)
N$35  (2 unrouted)
N$36  (2 unrouted)
N$37
  Top 0.406: SPACE.A 50.16,6 | 50.16,6 55.15,6 55.24,6.1 56.01,6.1 SPACE.A' | D37.A 50.65,5.51 50.16,6
N$38
  Top 0.406: 8.A 99.7,46.64 | 99.7,46.64 8.A' | D38.A 100.5,45.84 99.7,46.64
N$39
  Top 0.406: 9.A' 9.A 111.94,45.29 D39.A
N$40
  Top 0.406: 0.A' 0.A 123.36,45.29 D40.A
N$41
  Top 0.406: I.A 100.97,36.48 | 100.97,36.48 I.A' | D41.A 100.5,36.02 100.97,36.48
N$42
  Top 0.406: O.A 112.4,36.48 | 112.4,36.48 O.A' | D42.A 111.94,36.02 112.4,36.48
N$43
  Top 0.406: P.A 123.83,36.48 | 123.83,36.48 P.A' | D43.A 123.36,36.02 123.83,36.48
N$44
  Top 0.406: K.A 103.83,26.32 | 103.83,26.32 K.A' | D44.A 103.05,25.54 103.83,26.32
N$45
  Top 0.406: L.A 114.3,26.32 | 114.3,26.32 L.A' | D45.A 114.47,26.15 114.3,26.32
N$46
  Top 0.406: SEMICOL.A 126.37,26.32 | 126.37,26.32 SEMICOL.A' | D46.A 125.91,25.86 126.37,26.32
N$47
  Top 0.406: COMMA.A 105.09,16.16 | 105.09,16.16 COMMA.A' | D47.A 105.58,15.67 105.09,16.16
N$48
  Top 0.406: POINT.A 116.84,16.16 | 116.84,16.16 POINT.A' | D48.A 117.02,15.99 116.84,16.16
N$49
  Top 0.406: FWDSLASH.A 128.91,16.16 | 128.91,16.16 FWDSLASH.A' | D49.A 128.44,15.7 128.91,16.16
N$50  (2 unrouted)
N$51
  Top 0.406: SPACE2.A 78.61,6 | 78.61,6 SPACE2.A' | D51.A 79.42,5.2 78.61,6
N$52  (2 unrouted)
N$53
  Top 0.406: R-ALT.A 99.38,6 | 99.38,6 R-ALT.A' | D53.A 98.92,5.54 99.38,6
N$54
  Top 0.406: R-CTRL.A 114.94,6 | 114.94,6 R-CTRL.A' | D54.A 114.79,5.86 114.94,6
N$55
  Top 0.406: LEFT.A 130.68,4 | 130.68,4 LEFT.A' | 130.68,4 129.9,3.22 D55.A
N$56
  Top 0.406: -.A 133.99,46.64 | 133.99,46.64 -.A' | D56.A 134.79,45.84 133.99,46.64
N$57
  Top 0.406: =.A 145.74,46.64 | 145.74,46.64 =.A' | D57.A 146.22,46.15 145.74,46.64
N$58
  Top 0.406: BS.A 157.16,46.64 | 157.16,46.64 BS.A' | D58.A 157.66,46.15 157.16,46.64
N$59
  Top 0.406: [.A 134.94,36.48 | 134.94,36.48 139.61,36.48 139.7,36.58 140.15,36.58 [.A' | D59.A 134.79,36.34 134.94,36.48
N$60
  Top 0.406: ].A 147,36.48 | 147,36.48 ].A' | D60.A 146.22,35.7 147,36.48
N$61
  Top 0.406: BACKSLASH.A 157.8,36.48 | 157.8,36.48 BACKSLASH.A' | D61.A 157.66,36.34 157.8,36.48
N$62
  Top 0.406: QUOTE.A 137.8,26.32 | 137.8,26.32 QUOTE.A' | D62.A 137.34,25.86 137.8,26.32
N$63
  Top 0.406: ENTER.A 157.48,26.32 | 157.48,26.32 ENTER.A' | D63.A 157.66,26.15 157.48,26.32
N$64  (2 unrouted)
N$65
  Top 0.406: UP.A 142,16.16 | 142,16.16 142.88,16.16 | 142.88,16.16 UP.A' | 142.73,16.02 142.88,16.16 | 142,16.16 141.96,16.2 139.6,16.2 137.63,14.23 D65.A
N$66
  Top 0.406: RSHIFT.A 157.48,16.16 | 157.48,16.16 RSHIFT.A' | D66.A 157.66,15.99 157.48,16.16
N$67  (2 unrouted)
N$68
  Top 0.406: DOWN.A 143.19,4 | 143.19,4 DOWN.A' | D68.A 142.73,3.54 143.19,4
N$69
  Top 0.406: RIGHT.A 156.03,4 | 156.03,4 160.38,4 160.47,4.1 160.92,4.1 RIGHT.A' | D69.A 155.56,3.54 156.03,4
N$70  (via drill 3.2 pad 6)
  other vias: 3.5,3.5
N$72  (via drill 3.2 pad 6)
  other vias: 167.5,3.5
N$73  (via drill 3.2 pad 6)
  other vias: 167.5,82.5
N$74  (via drill 3.2 pad 6)
  other vias: 3.5,82.5
N$75
  Top 0.406: LED3.C R4.2
PROG
  Top 0.406: IC1.2 23.61,70.56 R3.2
ROW0  (via drill 0.5)
  Top 0.406: D1.C v14.93,43.56 | D58.C v163.51,43.56 163.58,43.5 v166.3,43.5 | D57.C v152.09,43.56 | D56.C v140.66,43.56 | D40.C v129.22,43.56 | D39.C v117.8,43.56 | D38.C v106.36,43.56 | D8.C v94.94,43.56 | D7.C v83.5,43.56 | D6.C v72.08,43.56 | D5.C v60.65,43.56 | D4.C v49.22,43.56 | D3.C v37.78,43.56 | D2.C v26.36,43.56
  Bottom 0.406: v14.93,43.56 v26.36,43.56 v37.78,43.56 v49.22,43.56 v60.65,43.56 v72.08,43.56 v83.5,43.56 v94.94,43.56 v106.36,43.56 v117.8,43.56 v129.22,43.56 v140.66,43.56 v152.09,43.56 v163.51,43.56 | v166.3,43.5 166.6,43.8 166.6,48.5 163.5,51.6 129.9,51.6 124.6,56.9 117.2,56.9 116.4,57.7 109.2,57.7 108.4,58.5 108.4,59.84 X1.13
ROW1  (via drill 0.5)
  Top 0.406: D9.C v14.93,33.4 | D61.C v163.51,33.4 v163.52,33.4 v166.3,33.4 | D60.C v152.09,33.4 | D59.C v140.66,33.4 | D43.C v129.22,33.4 | D42.C v117.8,33.4 | D41.C v106.36,33.4 | D16.C v94.94,33.4 | D15.C v83.5,33.4 | D14.C v72.08,33.4 | D13.C v60.65,33.4 | D12.C v49.22,33.4 | D11.C v37.78,33.4 | D10.C v26.36,33.4
  Bottom 0.406: v14.93,33.4 v26.36,33.4 v37.78,33.4 v49.22,33.4 v60.65,33.4 v72.08,33.4 v83.5,33.4 v94.94,33.4 v106.36,33.4 v117.8,33.4 v129.22,33.4 v140.66,33.4 v152.09,33.4 v163.51,33.4 | v166.3,33.4 166.6,33.7 166.6,41.7 165.4,42.9 165.4,44.2 165.8,44.6 165.8,48.2 163.2,50.8 129.6,50.8 124.3,56.1 116.9,56.1 116.1,56.9 108.7,56.9 105.77,59.83 X1.11
ROW2  (via drill 0.5)  (1 unrouted)
  Top 0.406: D17.C v14.93,23.24 | v163.51,23.24 D63.C | D62.C v143.19,23.24 | D46.C v131.76,23.24 | D45.C v120.33,23.24 | D44.C v108.91,23.24 | D24.C v97.47,23.24 | D23.C v86.05,23.24 | D22.C v74.61,23.24 | D21.C v63.19,23.24 | D20.C v51.76,23.24 | D19.C v40.33,23.24 | D18.C v28.89,23.24
  Bottom 0.406: v14.93,23.24 v28.89,23.24 v40.33,23.24 v51.76,23.24 v63.19,23.24 v74.61,23.24 v86.05,23.24 v97.47,23.24 v108.91,23.24 v120.33,23.24 v131.76,23.24 v143.19,23.24 v163.51,23.24 165.84,23.24 166.6,24 166.6,31.6 165.3,32.9 165.3,34.3 165.8,34.8 165.8,41.4 164.6,42.6 164.6,44.6 165,45 165,47.9 162.9,50 129.3,50 124,55.3 116.6,55.3 115.8,56.1 108.3,56.1 105.8,58.6 101.3,58.6 100.69,59.21 X1.7
ROW3  (via drill 0.5)  (1 unrouted)
  Top 0.406: D25.C v14.93,13.08 | v163.51,13.08 D66.C | D65.C v140.29,13.08 | D49.C v134.31,13.08 | D48.C v122.88,13.08 | D47.C v111.44,13.08 | D32.C v102.13,13.08 | D30.C v77.16,13.08 | D29.C v65.72,13.08 | D28.C v54.3,13.08 | D27.C v42.87,13.08 | D26.C v31.43,13.08 | D31.C 85.62,12.84 v84.08,12.28
  Bottom 0.406: v14.93,13.08 v31.43,13.08 v42.87,13.08 v54.3,13.08 v65.72,13.08 v77.16,13.08 77.4,13 84.1,13 84.08,13.02 v84.08,12.28 84.08,10.62 85.9,8.8 100.4,8.8 102,10.4 102,12.95 v102.13,13.08 v111.44,13.08 v122.88,13.08 v134.31,13.08 v140.29,13.08 | v140.29,13.08 140.99,13.09 | X1.16 112.1,61.22 112.1,59.1 112.7,58.5 116.8,58.5 117.6,57.7 124.9,57.7 130.2,52.4 163.8,52.4 167.4,48.8 167.4,16.7 163.8,13.1 163.53,13.1 v163.51,13.08 163.4,13.2 150.8,13.2 148.2,15.8 141.9,15.8 140.3,14.2 v140.3,13.09 v140.29,13.08
ROW4  (via drill 0.5)  (5 unrouted)
  Top 0.406: D33.C v19.43,2.82 | v161.42,1.62 D69.C | D68.C v148.59,1.62 | D55.C v137.16,1.62 | D54.C v120.65,2.92 | D53.C v104.78,2.92 | D51.C v85.28,2.92 | D37.C v56.51,2.92 | D35.C v35.88,2.92
  Bottom 0.406: v19.43,2.82 35.82,2.82 35.9,2.9 v35.88,2.92 v56.51,2.92 v85.28,2.92 v104.78,2.92 v120.65,2.92 135.86,2.92 v137.16,1.62 v148.59,1.62 v161.42,1.62 161.4,3.6 168.2,10.4 168.2,49.1 164.1,53.2 130.5,53.2 125.2,58.5 117.9,58.5 117.2,59.2 117.2,60.8 116.8,61.2 114.66,61.2 X1.18
SBYLED
  Top 0.406: IC1.6 13.68,71.83 R2.1
SPCEBAR
  Top 0.406: L-ALT.A 30.16,6 | 30.16,6 L-ALT.A' | D35.A 30.02,5.86 30.16,6
STANDBY
  Top 0.406: R2.2 6.11,72.51 LED2.C
VCC  (1 unrouted)
  Top 0.406: LED2.A LED1.A 1.43,67.77 1.8,67.4 | 1.8,67.4 13.73,67.4 IC1.8 | IC1.4 21.5,73.11 22,73.6 22,75.6 22.8,76.4 23.7,76.4 C1.1 | LED3.A 1.45,67.05 1.8,67.4

### Text on the board
BENHECKSILKSCREEN: FULL | CHARGE | DC-POWER | 1 | ! | 2 | @ | 3 | # | 4 | $ | 5 | % | 6 | 7 | & | 8 | * | 9 | ( | 0 | ) | - | _ | = | + | ` | ~ | ^ | Q | W | E | R | T | Y | U | I | O | P | [ | ] | \\ | | | TAB | A | ; | : | ' | S | D | F | G | H | J | K | L | " | ENTER | CAPS | Z | X | C | V | B | N | M | , | < | . | > | / | ? | SHIFT | SHIFT | ALT | SPACE | ALT | CTRL | CTRL | TODO: / / - Add Boost circuit / - Add Lipo Monitor (Thinking INA219 over I2C to Pi to read battery status in software) / - Add power switch / - Add DC-IN socket / - There are a few extra buttons on the Matrix, not defined by TBHS-EP244 - can be added for something? | Features / / - 2 x 18650 cell holders on rear of PCB / - 1 x PI on rear of PCB. Parallel - so needs only a boost converter / - Onboard TP4056 Lipo Charger set to 1A charge rate / - Keyboard Matrix from TBHS Ep 244